# Altium schematic sheet comms.SchDoc
size A4; SheetNumber: 1; SheetTotal: 8
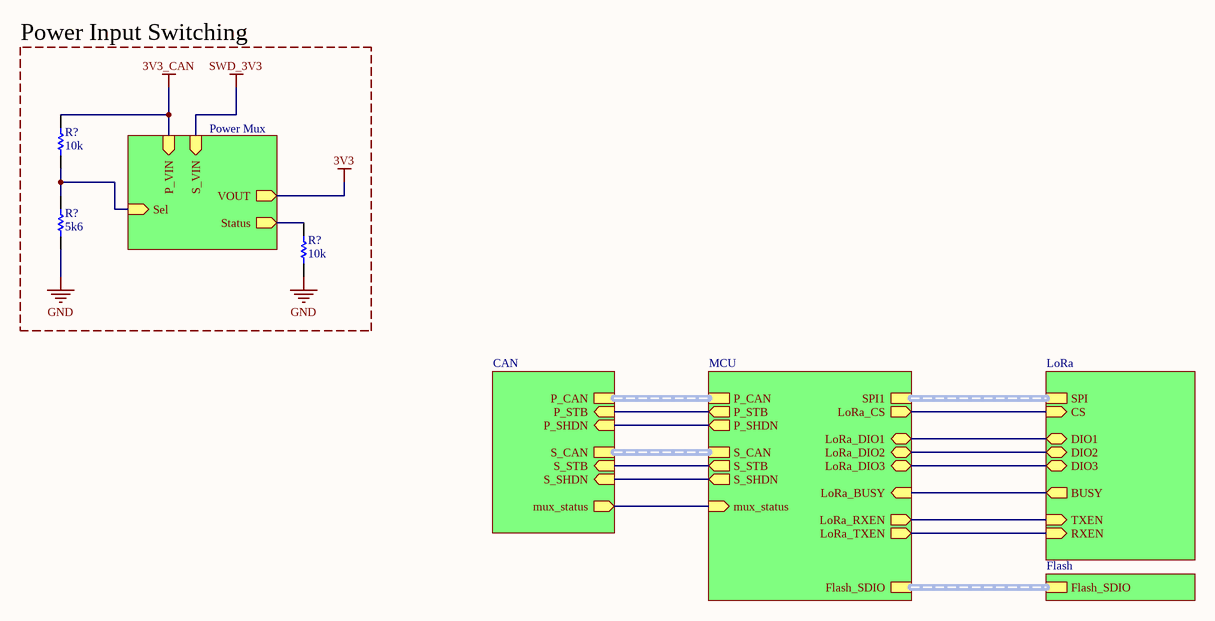
[diagram p0: comms.SchDoc]

## Parts
(Parts that share a designator on the sheet are numbered #1, #2 ... from top to bottom, then left to right.)
R?#1  10k
R?#2  5k6
R?#3  10k

## Blocks framed on the sheet
Power Input Switching: R?#1-R?#3

## Sub-sheets
CAN = CAN_bus_powered: P_CAN (harness CAN), P_STB (in), P_SHDN (in), S_CAN (harness CAN), S_STB (in), S_SHDN (in), mux_status (out)
Flash = flash: Flash_SDIO (harness SDIO)
LoRa = lora: SPI (harness SPI), DIO1 (bidir), DIO2 (bidir), DIO3 (bidir), BUSY (out), TXEN (in), RXEN (in), CS (in)
MCU = mcu: Flash_SDIO (harness SDIO), LoRa_CS (out), SPI1 (harness SPI), LoRa_BUSY (in), LoRa_RXEN (out), LoRa_TXEN (out), LoRa_DIO1 (bidir), LoRa_DIO2 (bidir), LoRa_DIO3 (bidir), mux_status (in), P_STB (out), P_SHDN (out), S_STB (out), S_SHDN (out), S_CAN (harness CAN), P_CAN (harness CAN)
Power Mux = power_mux: P_VIN (in), S_VIN (in), Sel (in), VOUT (out), Status (out)

## Nets
3V3: sheet Power Mux/VOUT
3V3_CAN: R?#1.2 ; sheet Power Mux/P_VIN
GND: R?#2.1 R?#3.1
SWD_3V3: sheet Power Mux/S_VIN
NetR?#1_1: R?#1.1 R?#2.2 ; sheet Power Mux/Sel
NetR?#3_2: R?#3.2 ; sheet Power Mux/Status
(unnamed): sheet MCU/LoRa_CS, sheet LoRa/CS
(unnamed): sheet MCU/LoRa_BUSY, sheet LoRa/BUSY
(unnamed): sheet MCU/LoRa_RXEN, sheet LoRa/TXEN
(unnamed): sheet MCU/LoRa_TXEN, sheet LoRa/RXEN
(unnamed): sheet MCU/LoRa_DIO1, sheet LoRa/DIO1
(unnamed): sheet MCU/LoRa_DIO2, sheet LoRa/DIO2
(unnamed): sheet MCU/LoRa_DIO3, sheet LoRa/DIO3
(unnamed): sheet MCU/mux_status, sheet CAN/mux_status
(unnamed): sheet MCU/P_STB, sheet CAN/P_STB
(unnamed): sheet MCU/P_SHDN, sheet CAN/P_SHDN
(unnamed): sheet MCU/S_STB, sheet CAN/S_STB
(unnamed): sheet MCU/S_SHDN, sheet CAN/S_SHDN

## Buses and harness runs
harness sheet CAN/P_CAN = sheet MCU/P_CAN
harness sheet CAN/S_CAN = sheet MCU/S_CAN
harness sheet Flash/Flash_SDIO = sheet MCU/Flash_SDIO
harness sheet LoRa/SPI = sheet MCU/SPI1

## Library data of the parts
R?#1-R?#3 = Resistor